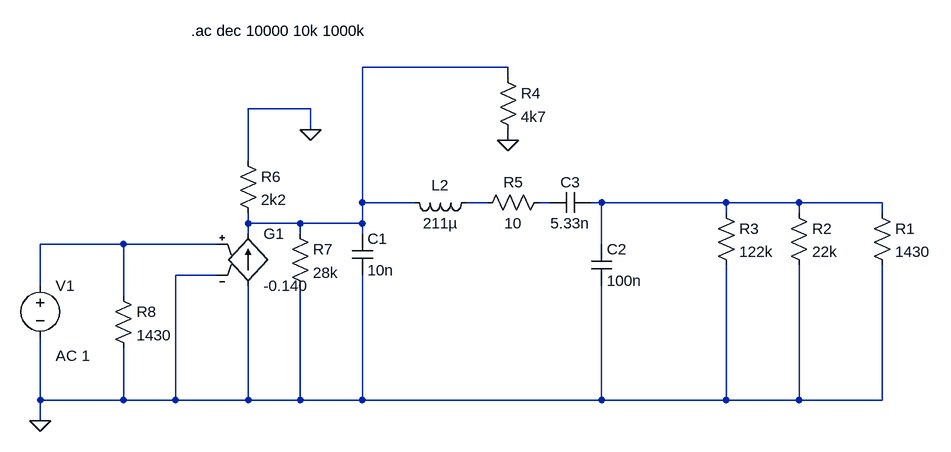
[diagram p0: schematic labosc2.asc]
labosc2.asc, the LTspice schematic file:
Version 4
SHEET 1 3972 680
WIRE 672 -112 448 -112
WIRE 672 -96 672 -112
WIRE 368 -48 272 -48
WIRE 368 -16 368 -48
WIRE 672 0 672 -16
WIRE 272 32 272 -48
WIRE 448 96 448 -112
WIRE 528 96 448 96
WIRE 640 96 608 96
WIRE 736 96 720 96
WIRE 816 96 800 96
WIRE 1008 96 816 96
WIRE 1120 96 1008 96
WIRE 1248 96 1120 96
WIRE 1008 112 1008 96
WIRE 1120 112 1120 96
WIRE 1248 112 1248 96
WIRE 272 128 272 112
WIRE 352 128 272 128
WIRE 448 128 448 96
WIRE 448 128 352 128
WIRE 272 144 272 128
WIRE 352 144 352 128
WIRE 448 144 448 128
WIRE 80 160 -48 160
WIRE 224 160 80 160
WIRE 816 160 816 96
WIRE 224 208 160 208
WIRE -48 224 -48 160
WIRE 80 240 80 160
WIRE -48 400 -48 304
WIRE 80 400 80 320
WIRE 80 400 -48 400
WIRE 160 400 160 208
WIRE 160 400 80 400
WIRE 272 400 272 224
WIRE 272 400 160 400
WIRE 352 400 352 224
WIRE 352 400 272 400
WIRE 448 400 448 208
WIRE 448 400 352 400
WIRE 816 400 816 224
WIRE 816 400 448 400
WIRE 1008 400 1008 192
WIRE 1008 400 816 400
WIRE 1120 400 1120 192
WIRE 1120 400 1008 400
WIRE 1248 400 1248 192
WIRE 1248 400 1120 400
WIRE -48 432 -48 400
FLAG 672 0 0
FLAG 368 -16 0
FLAG -48 432 0
SYMBOL res 1104 96 R0
SYMATTR InstName R2
SYMATTR Value 22k
SYMBOL res 992 96 R0
SYMATTR InstName R3
SYMATTR Value 122k
SYMBOL cap 432 144 R0
SYMATTR InstName C1
SYMATTR Value 10n
SYMBOL ind 624 80 R90
WINDOW 0 5 56 VBottom 2
WINDOW 3 32 56 VTop 2
SYMATTR InstName L2
SYMATTR Value 211µ
SYMBOL cap 800 160 R0
SYMATTR InstName C2
SYMATTR Value 100n
SYMBOL cap 800 80 R90
WINDOW 0 0 32 VBottom 2
WINDOW 3 32 32 VTop 2
SYMATTR InstName C3
SYMATTR Value 5.33n
SYMBOL res 656 -112 R0
SYMATTR InstName R4
SYMATTR Value 4k7
SYMBOL res 736 80 R90
WINDOW 0 0 56 VBottom 2
WINDOW 3 32 56 VTop 2
SYMATTR InstName R5
SYMATTR Value 10
SYMBOL res 256 16 R0
SYMATTR InstName R6
SYMATTR Value 2k2
SYMBOL g 272 128 R0
SYMATTR InstName G1
SYMATTR Value -0.140
SYMBOL res 336 128 R0
SYMATTR InstName R7
SYMATTR Value 28k
SYMBOL res 1232 96 R0
SYMATTR InstName R1
SYMATTR Value 1430
SYMBOL res 64 224 R0
SYMATTR InstName R8
SYMATTR Value 1430
SYMBOL voltage -48 208 R0
WINDOW 123 24 124 Left 2
WINDOW 39 0 0 Left 0
SYMATTR InstName V1
SYMATTR Value ""
SYMATTR Value2 AC 1
TEXT 184 -168 Left 2 !.ac dec 10000 10k 1000k

The netlist it stands for:
* labosc2.asc
R2 N004 0 22k
R3 N004 0 122k
C1 N001 0 10n
L2 N002 N001 211µ
C2 N004 0 100n
C3 N004 N003 5.33n
R4 N001 0 4k7
R5 N003 N002 10
R6 0 N001 2k2
G1 0 N001 N005 0 -0.140
R7 N001 0 28k
R1 N004 0 1430
R8 N005 0 1430
V1 N005 0 AC 1
.ac dec 10000 10k 1000k
.backanno
.end